# EAGLE design coop assistant (EAGLE 9.6.2)

## Sheet 1 of 3: POWER, MCU, ADC
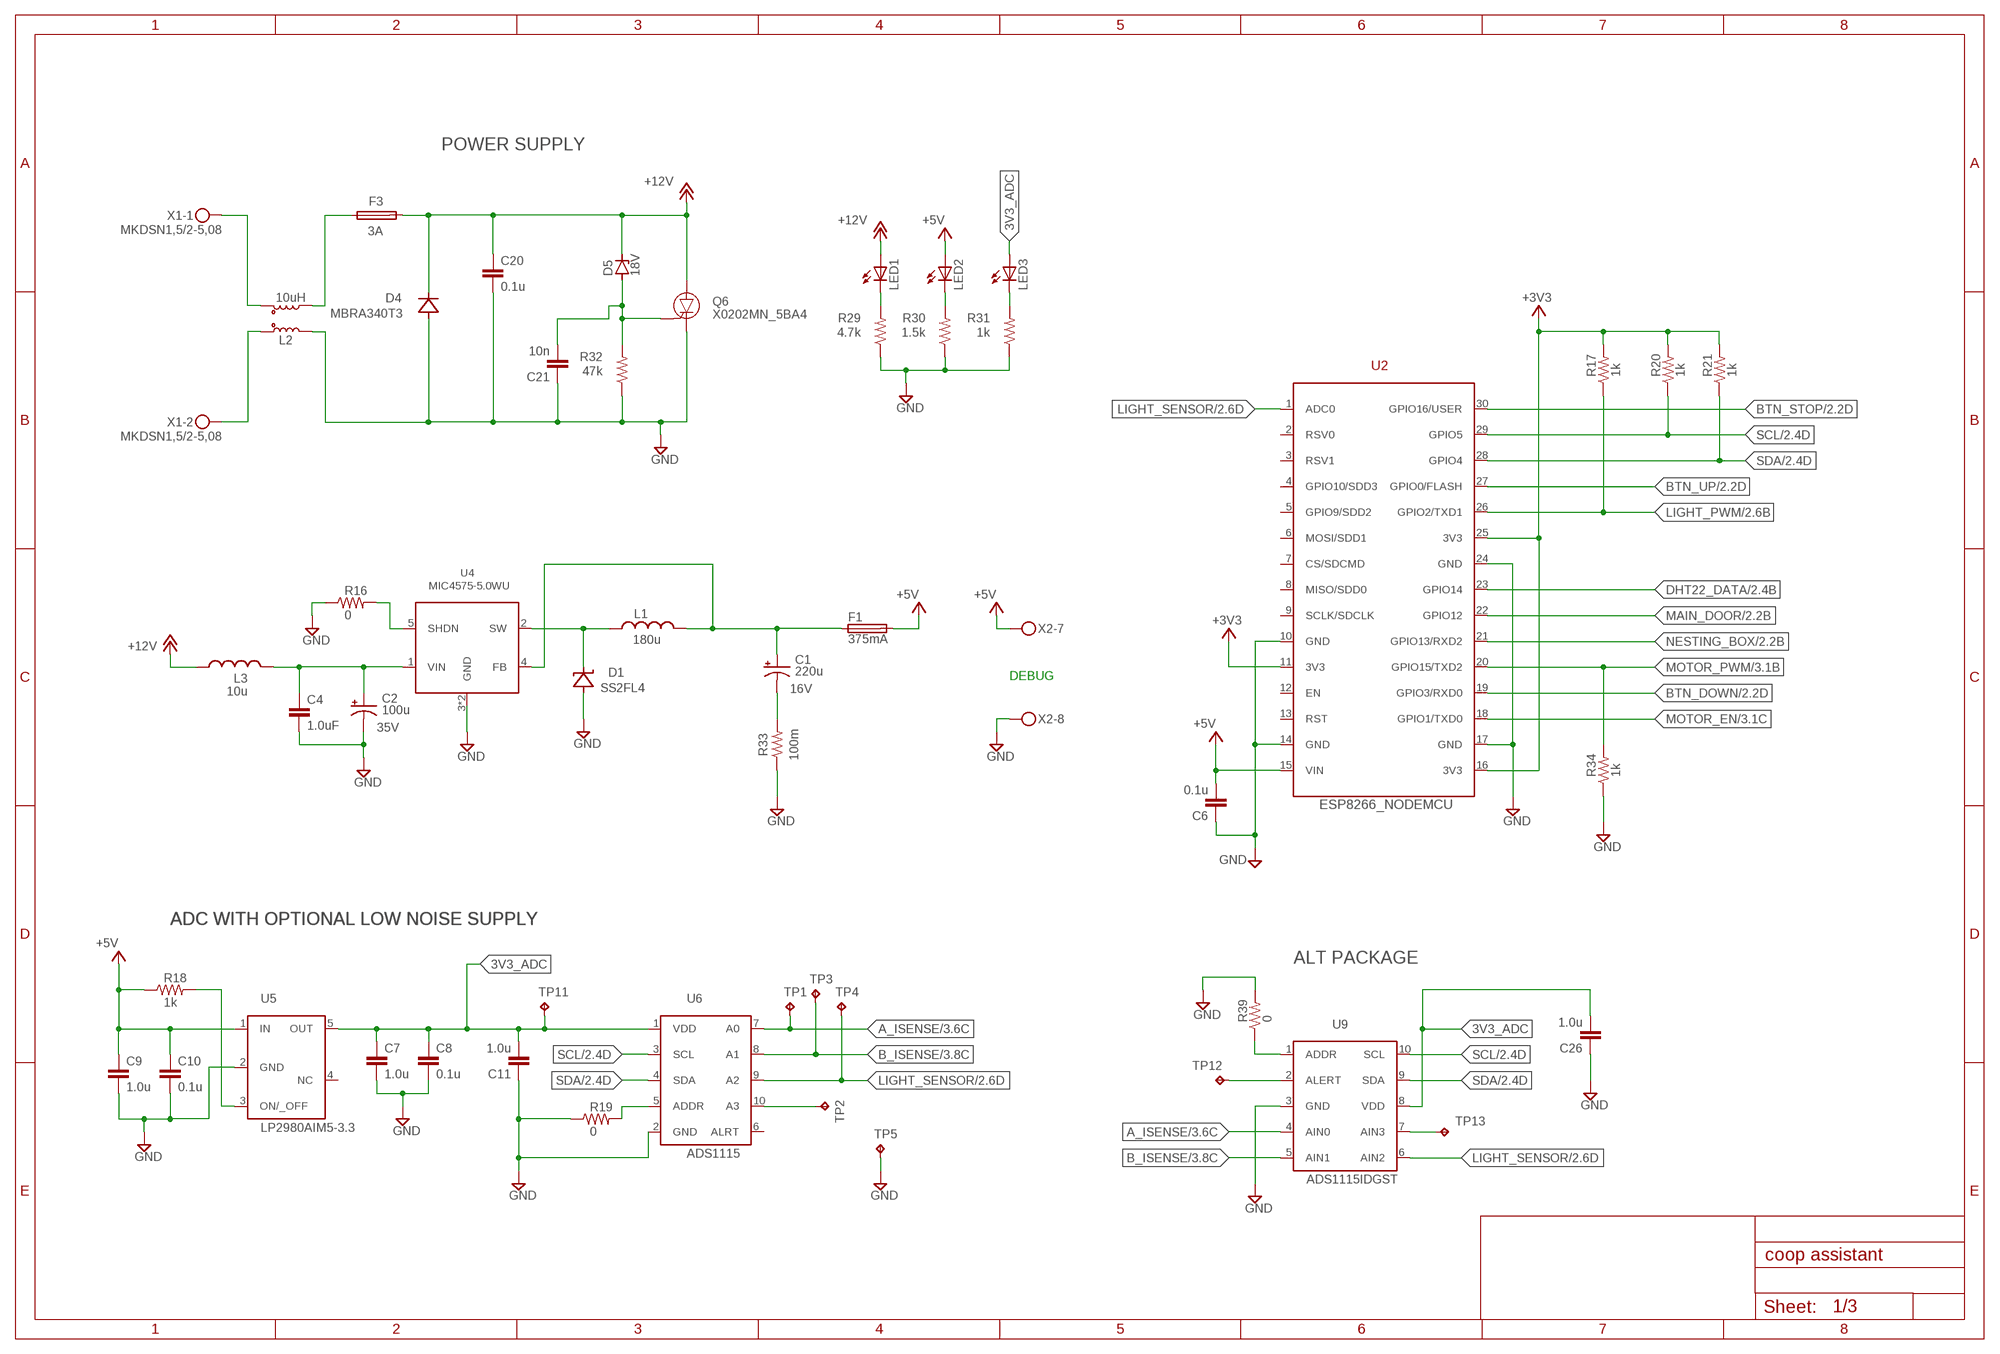
[diagram p0: schematic, sheet 1]

### Parts
C1  220u  CPOLRAD6.3X8  [CAPPRD250W50D630H800B]
C2  100u  CPOLRAD8X12  [CAPPRD350W60D800H1200B]
C4  1.0uF  1.0UF-0805-25V-10%  [0805]
C6  0.1u  1.0UF-0603-16V-10%  [0603]
C7  1.0u  1.0UF-0805-25V-10%  [0805]
C8  0.1u  1.0UF-0603-16V-10%  [0603]
C9  1.0u  1.0UF-0805-25V-10%  [0805]
C10  0.1u  1.0UF-0603-16V-10%  [0603]
C11  1.0u  1.0UF-0805-25V-10%  [0805]
C20  0.1u  C-EUC0805  [C0805]
C21  10n  C-EUC0805  [C0805]
C26  1.0u  1.0UF-0805-25V-10%  [0805]
D1  SS2FL4  [SMF]
D4  MBRA340T3  [SMA]
D5  18V  ZENER-DIODESOT23  [SOT23]
F1  375mA  494SERIESFUSE  [0603]
F3  3A  154_OMNIBLOKF154  [FUSM9750X381N]
L1  180u  MSS1278  [INDM120120X780N]
L2  10uH  COILCRAFT_MSD1260  [COILCRAFT_MSD1260]
L3  10u  MSS1278  [INDM120120X780N]
LED1  LEDCHIP-LED0805  [CHIP-LED0805]
LED2  LEDCHIP-LED0805  [CHIP-LED0805]
LED3  LEDCHIP-LED0805  [CHIP-LED0805]
Q6  X0202MN_5BA4  [SOT-223]
R16  0  R-US_R0805  [R0805]
R17  1k  R-US_R0805  [R0805]
R18  1k  R-US_R0805  [R0805]
R19  0  R-US_R0805  [R0805]
R20  1k  R-US_R0805  [R0805]
R21  1k  R-US_R0805  [R0805]
R29  4.7k  R-US_R0805  [R0805]
R30  1.5k  R-US_R0805  [R0805]
R31  1k  R-US_R0805  [R0805]
R32  47k  R-US_R0805  [R0805]
R33  100m  R-US_CHIP-1206(3216-METRIC)  [RESC3216X70]
R34  1k  R-US_R0805  [R0805]
R39  0  R-US_R0805  [R0805]
TP1  TPTP15SQ  [TP15SQ]
TP2  TPTP15SQ  [TP15SQ]
TP3  TPTP15SQ  [TP15SQ]
TP4  TPTP15SQ  [TP15SQ]
TP5  TPTP15SQ  [TP15SQ]
TP11  TPTP15SQ  [TP15SQ]
TP12  TPTP15SQ  [TP15SQ]
TP13  TPTP15SQ  [TP15SQ]
U2  ESP8266_NODEMCU  [NODEMCUESP8266]
U4  MIC4575-5.0WU  [TO263-5]
U5  LP2980AIM5-3.3  [SOT23-5]
U6  ADS1115  [HDRV10W64P254_1X10_2800X508X838B]
U9  ADS1115IDGST  [10VSSOP]
X1  MKDSN1,5/2-5,08  [MKDSN1,5/2-5,08]
X2  MKDSN1,5/8-5,08  [MKDSN1,5/8-5,08]

### Nets
3V3_ADC [Power]: C7.1 C8.1 C11.2 C26.2 LED3.A TP11.TP U5.5(OUT) U6.1(VDD) U9.8(VDD)
5VBUCK_SHDN [Power]: R16.2 U4.5(SHDN)
5VBUCK_SW [Power]: D1.K(C) L1.1 U4.2(SW)
5VBUCK_VIN [Power]: C2.POS(+) C4.1 L3.2 U4.1(VIN)
5VBUCK_VOUT [Power]: C1.POS(+) F1.1 L1.2 U4.4(FB)
5VBUCK_VOUT_ESR [Power]: C1.NEG(-) R33.2
+3V3 [Power]: R17.2 R20.2 R21.2 U2.11(3V3) U2.16(3V3) U2.25(3V3) ; also sheet 2,3
+5V [Power]: C6.2 C9.1 C10.1 F1.2 LED2.A R18.1 U2.15(VIN) U5.1(IN) X2.7
+12V [Power]: C20.1 D4.C D5.3(C) F3.2 L3.1 LED1.A Q6.A Q6.A1(A) ; also sheet 2,3
+12V_PREFUSE [Power]: F3.1 L2.3
A_ISENSE [Analog]: TP1.TP U6.7(A0) U9.4(AIN0) ; also sheet 3
ADS1115_ADDR [Logic]: R19.2 U6.5(ADDR)
B_ISENSE [Analog]: TP3.TP U6.8(A1) U9.5(AIN1) ; also sheet 3
BTN_DOWN [Control]: U2.19(GPIO3/RXD0) ; also sheet 2
BTN_STOP [Control]: U2.30(GPIO16/USER) ; also sheet 2
BTN_UP [Control]: U2.27(GPIO0/FLASH) ; also sheet 2
DHT22_DATA [Logic]: U2.23(GPIO14) ; also sheet 2
GND [Power]: C2.NEG(-) C4.2 C6.1 C7.2 C8.2 C9.2 C10.2 C11.1 C20.2 C21.1 C26.1 D1.A D4.A L2.4 Q6.K R16.1 R19.1 R29.1 R30.1 R31.1 R32.1 R33.1 R34.1 R39.2 TP5.TP U2.10(GND) U2.14(GND) U2.17(GND) U2.24(GND) U4.3(GND) U4.6(GND) U5.2(GND) U6.2(GND) U9.3(GND) X2.8 ; also sheet 2,3
LED_3V3_ADC [Analog]: LED3.C R31.2
LED_5V [Analog]: LED2.C R30.2
LED_12V [Analog]: LED1.C R29.2
LIGHT_PWM [Control]: R17.1 U2.26(GPIO2/TXD1) ; also sheet 2
LIGHT_SENSOR [Control]: TP4.TP U2.1(ADC0) U6.9(A2) U9.6(AIN2) ; also sheet 2
MAIN_DOOR [Control]: U2.22(GPIO12) ; also sheet 2
MOTOR_EN [Control]: U2.18(GPIO1/TXD0) ; also sheet 3
MOTOR_PWM [Control]: R34.2 U2.20(GPIO15/TXD2) ; also sheet 3
N$1: TP2.TP U6.10(A3)
N$2: TP12.TP U9.2(ALERT)
N$3: R39.1 U9.1(ADDR)
N$4: TP13.TP U9.7(AIN3)
NESTING_BOX [Control]: U2.21(GPIO13/RXD2) ; also sheet 2
SCL [Logic]: R20.1 U2.29(GPIO5) U6.3(SCL) U9.10(SCL) ; also sheet 2
SDA [Logic]: R21.1 U2.28(GPIO4) U6.4(SDA) U9.9(SDA) ; also sheet 2
VADC_EN [Logic]: R18.2 U5.3(ON/_OFF)
VIN+ [Power]: L2.1 X1.1
VIN- [Power]: L2.2 X1.2
VIN_CROWBAR_GATE [Control]: C21.2 D5.1(A) Q6.G R32.2
Unconnected: U2.2(RSV0) U2.3(RSV1) U2.4(GPIO10/SDD3) U2.5(GPIO9/SDD2) U2.6(MOSI/SDD1) U2.7(CS/SDCMD) U2.8(MISO/SDD0) U2.9(SCLK/SDCLK) U2.12(EN) U2.13(RST) U5.4(NC) U6.6(ALRT)

### Notes on the sheet
- POWER SUPPLY
- DEBUG
- ADC WITH OPTIONAL LOW NOISE SUPPLY | ADC WITH OPTIONAL LOW NOISE SUPPLY
- ALT PACKAGE

## Sheet 2 of 3: SENSORS AND INPUTS
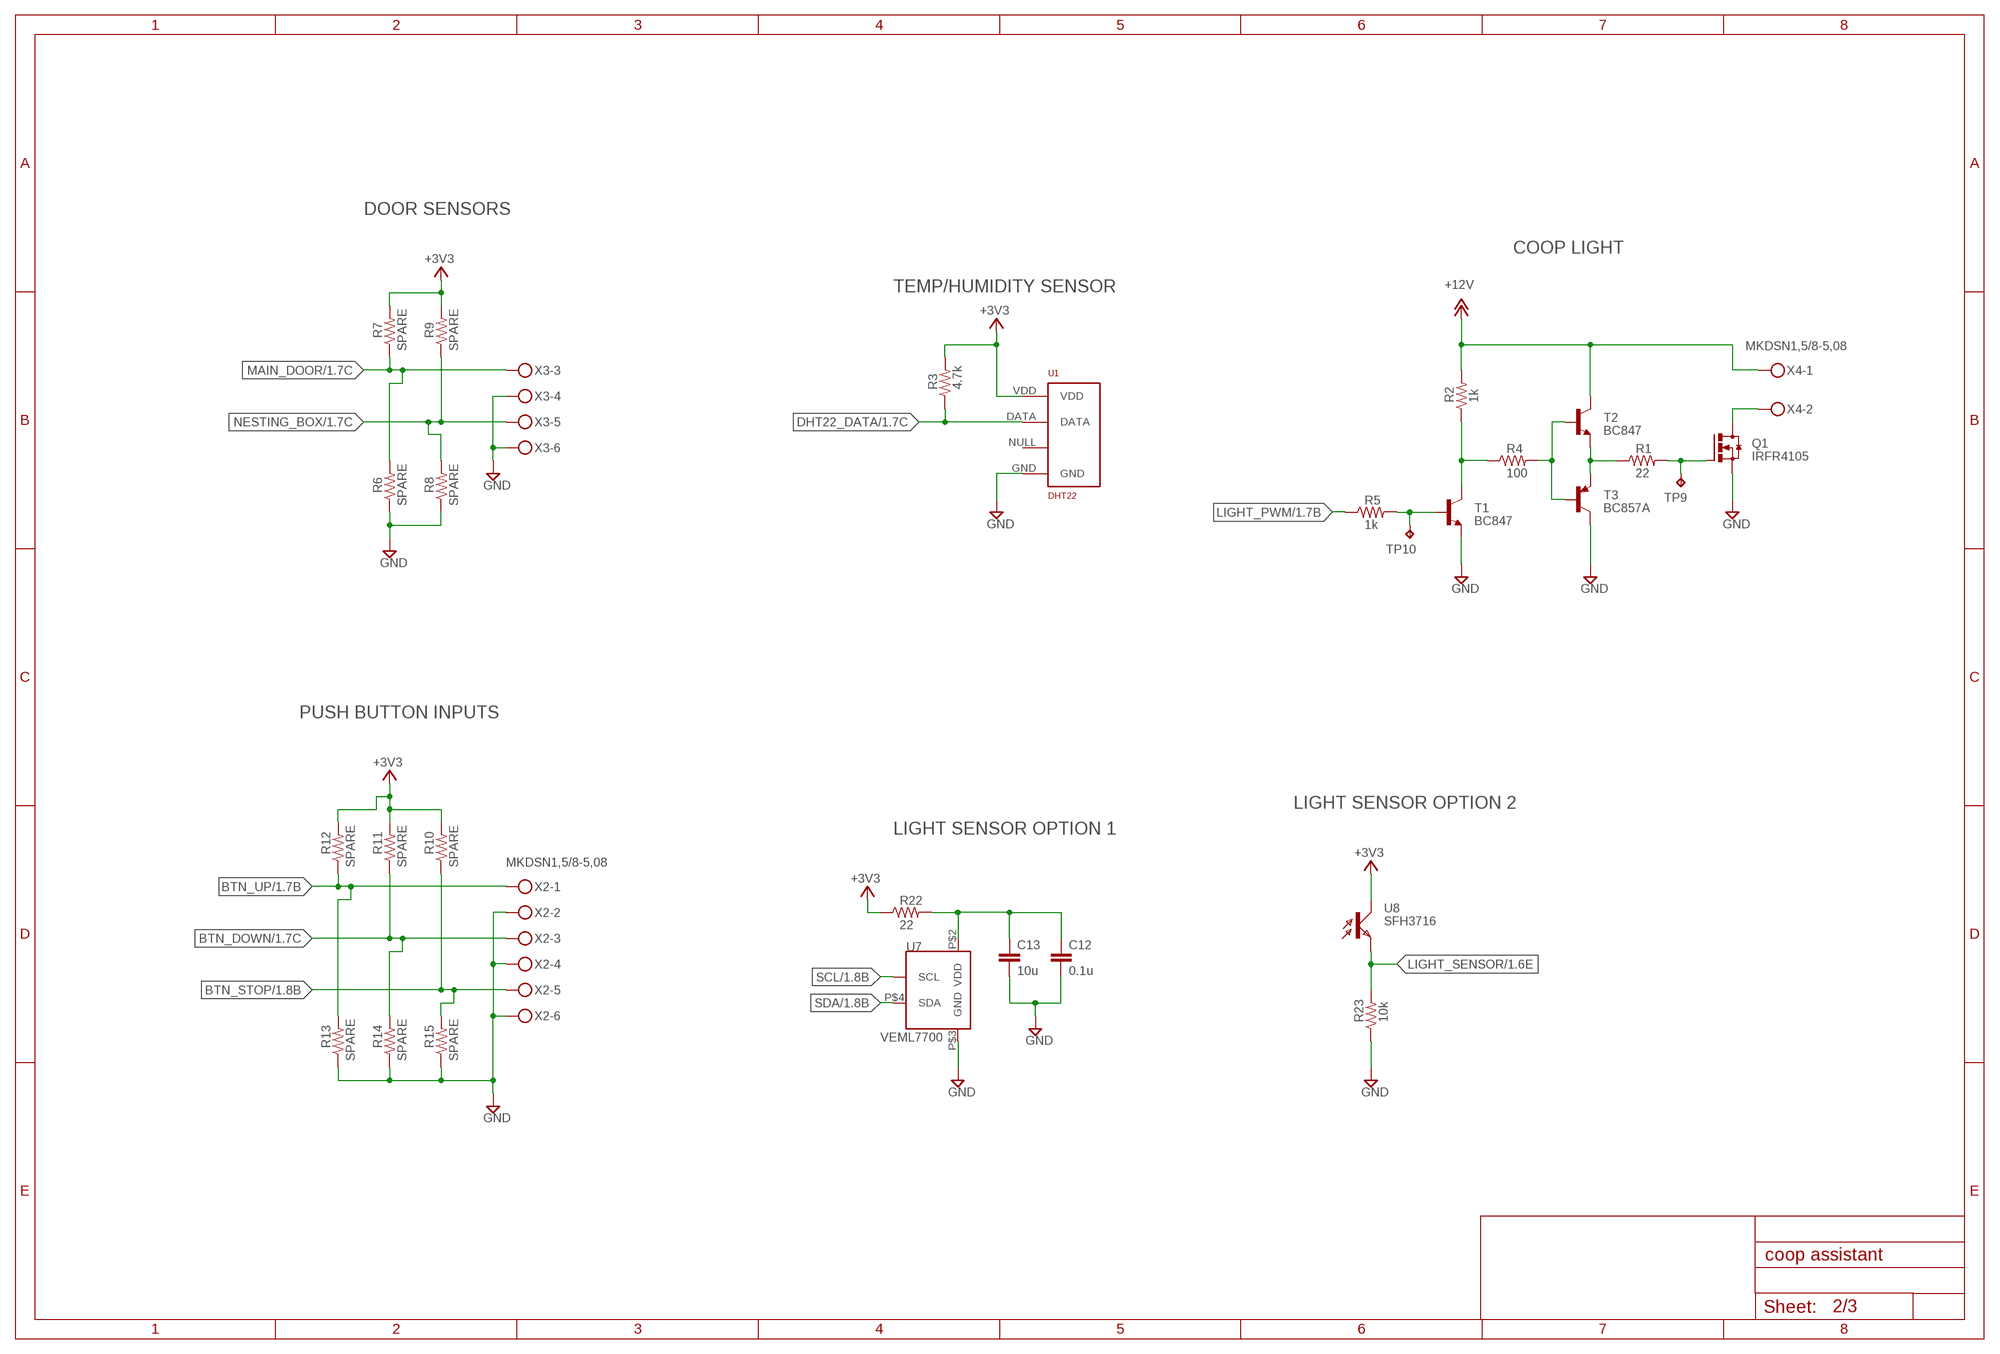
[diagram p1: schematic, sheet 2]

### Parts
C12  0.1u  1.0UF-0603-16V-10%  [0603]
C13  10u  1.0UF-0805-25V-(+80/-20%)  [0805]
Q1  IRFR4105  [TO252]
R1  22  R-US_R0805  [R0805]
R2  1k  R-US_R0805  [R0805]
R3  4.7k  R-US_R0805  [R0805]
R4  100  R-US_R0805  [R0805]
R5  1k  R-US_R0805  [R0805]
R6  SPARE  R-US_R0805  [R0805]
R7  SPARE  R-US_R0805  [R0805]
R8  SPARE  R-US_R0805  [R0805]
R9  SPARE  R-US_R0805  [R0805]
R10  SPARE  R-US_R0805  [R0805]
R11  SPARE  R-US_R0805  [R0805]
R12  SPARE  R-US_R0805  [R0805]
R13  SPARE  R-US_R0805  [R0805]
R14  SPARE  R-US_R0805  [R0805]
R15  SPARE  R-US_R0805  [R0805]
R22  22  R-US_R0805  [R0805]
R23  10k  R-US_R0805  [R0805]
T1  BC847  [SOT23]
T2  BC847  [SOT23]
T3  BC857A  [SOT23-BEC]
TP9  TPTP15SQ  [TP15SQ]
TP10  TPTP15SQ  [TP15SQ]
U1  DHT22  RHT03_DHT-22_AM2302RA  [RHT03_DHT-22/RA]
U7  VEML7700  [VEML7700]
U8  SFH3716  [0805]
X3  MKDSN1,5/8-5,08  [MKDSN1,5/8-5,08]
X4  MKDSN1,5/8-5,08  [MKDSN1,5/8-5,08]

### Nets
+3V3 [Power]: R3.2 R7.2 R9.2 R10.2 R11.2 R12.2 R22.1 U1.VDD U8.1(C) ; also sheet 1,3
+12V [Power]: R2.2 T2.3(C) X4.1 ; also sheet 1,3
BTN_DOWN [Control]: R11.1 R14.2 X2.3 ; also sheet 1
BTN_STOP [Control]: R10.1 R15.2 X2.5 ; also sheet 1
BTN_UP [Control]: R12.1 R13.2 X2.1 ; also sheet 1
DHT22_DATA [Logic]: R3.1 U1.DATA ; also sheet 1
GND [Power]: C12.2 C13.2 Q1.2(S) R6.1 R8.1 R13.1 R14.1 R15.1 R23.1 T1.2(E) T3.C U1.GND U7.P$3(GND) X2.2 X2.4 X2.6 X3.4 X3.6 ; also sheet 1,3
LIGHT_GATE_PRERES [Control]: R1.1 T2.2(E) T3.E
LIGHT_OUT [Light]: Q1.3(D) X4.2
LIGHT_PWM [Control]: R5.1 ; also sheet 1
LIGHT_PWM_BASE [Control]: R5.2 T1.1(B) TP10.TP
LIGHT_PWM_EMITTER [Control]: R2.1 R4.1 T1.3(C)
LIGHT_PWM_TOTEM [Control]: R4.2 T2.1(B) T3.B
LIGHT_SENSOR [Control]: R23.2 U8.2(E) ; also sheet 1
LIGHT_SENSOR_VDD [Control]: C12.1 C13.1 R22.2 U7.P$2(VDD)
LIGHT_VGATE [Control]: Q1.1(G) R1.2 TP9.TP
MAIN_DOOR [Control]: R6.2 R7.1 X3.3 ; also sheet 1
NESTING_BOX [Control]: R8.2 R9.1 X3.5 ; also sheet 1
SCL [Logic]: U7.P$1(SCL) ; also sheet 1
SDA [Logic]: U7.P$4(SDA) ; also sheet 1
Unconnected: U1.NULL X3.1 X3.2 X3.7 X3.8 X4.3 X4.4 X4.5 X4.6

### Notes on the sheet
- DOOR SENSORS
- COOP LIGHT
- TEMP/HUMIDITY SENSOR
- PUSH BUTTON INPUTS
- LIGHT SENSOR OPTION 2
- LIGHT SENSOR OPTION 1

## Sheet 3 of 3: MOTOR DRIVE
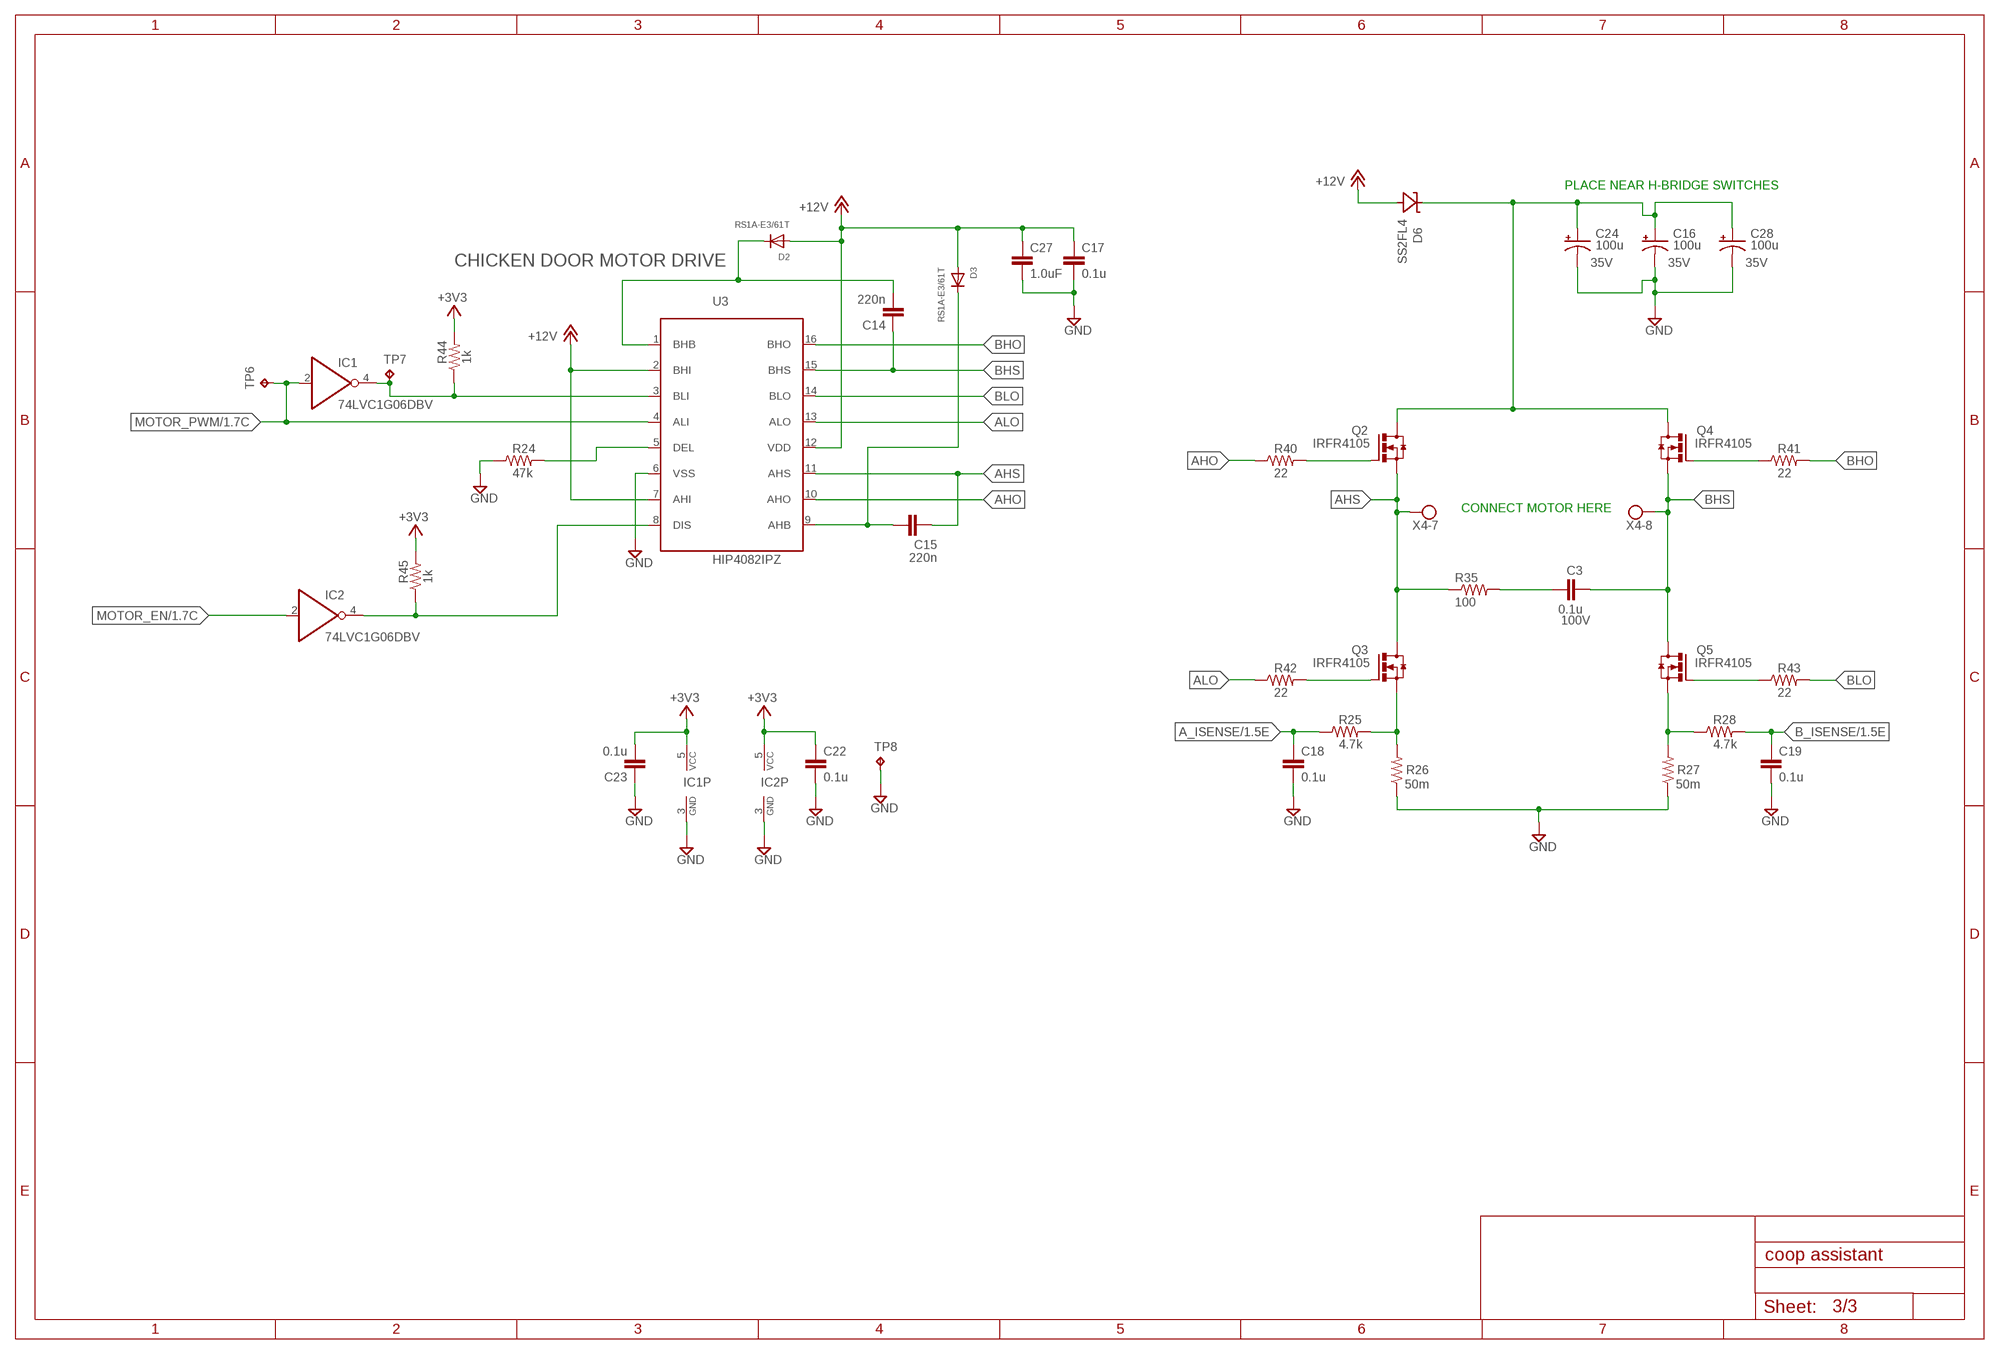
[diagram p2: schematic, sheet 3]

### Parts
C3  0.1u  C-EUC0805  [C0805]
C14  220n  1.0UF-0805-25V-(+80/-20%)  [0805]
C15  220n  1.0UF-0805-25V-(+80/-20%)  [0805]
C16  100u  CPOLRAD8X12  [CAPPRD350W60D800H1200B]
C17  0.1u  1.0UF-0603-16V-10%  [0603]
C18  0.1u  1.0UF-0603-16V-10%  [0603]
C19  0.1u  1.0UF-0603-16V-10%  [0603]
C22  0.1u  1.0UF-0603-16V-10%  [0603]
C23  0.1u  1.0UF-0603-16V-10%  [0603]
C24  100u  CPOLRAD8X12  [CAPPRD350W60D800H1200B]
C27  1.0uF  1.0UF-0805-25V-10%  [0805]
C28  100u  CPOLRAD8X12  [CAPPRD350W60D800H1200B]
D2  RS1A-E3/61T  DIODESMA  [SMADIODE]
D3  RS1A-E3/61T  DIODESMA  [SMADIODE]
D6  SS2FL4  [SMF]
IC1  74LVC1G06DBV  [SOT23-5]
IC2  74LVC1G06DBV  [SOT23-5]
Q2  IRFR4105  [TO252]
Q3  IRFR4105  [TO252]
Q4  IRFR4105  [TO252]
Q5  IRFR4105  [TO252]
R24  47k  R-US_R0805  [R0805]
R25  4.7k  R-US_R0805  [R0805]
R26  50m  R-US_R2512  [R2512]
R27  50m  R-US_R2512  [R2512]
R28  4.7k  R-US_R0805  [R0805]
R35  100  R-US_R2512  [R2512]
R40  22  R-US_R0805  [R0805]
R41  22  R-US_R0805  [R0805]
R42  22  R-US_R0805  [R0805]
R43  22  R-US_R0805  [R0805]
R44  1k  R-US_R0805  [R0805]
R45  1k  R-US_R0805  [R0805]
TP6  TPTP15SQ  [TP15SQ]
TP7  TPTP15SQ  [TP15SQ]
TP8  TPTP15SQ  [TP15SQ]
U3  HIP4082IPZ  [DIP762W53P254L1969H508Q16B]

### Nets
+3V3 [Power]: C22.1 C23.2 IC1.5(VCC) IC2.5(VCC) R44.2 R45.2 ; also sheet 1,2
+12V [Power]: C17.1 C27.1 D2.A D3.A D6.A U3.2(BHI) U3.7(AHI) U3.12(VDD) ; also sheet 1,2
+12V_MOTOR [Power]: C16.POS(+) C24.POS(+) C28.POS(+) D6.K(C) Q2.3(D) Q4.3(D)
/MOTOR_EN [Control]: IC2.4(O) R45.1 U3.8(DIS)
/MOTOR_PWM [Control]: IC1.4(O) R44.1 TP7.TP U3.3(BLI)
A_ISENSE [Analog]: C18.1 R25.1 ; also sheet 1
AHO [Control]: R40.1 U3.10(AHO)
AHO_G: Q2.1(G) R40.2
AHS [Motor]: C15.2 Q2.2(S) Q3.3(D) R35.1 U3.11(AHS) X4.7
ALO [Control]: R42.1 U3.13(ALO)
ALO_G: Q3.1(G) R42.2
ALS [Motor]: Q3.2(S) R25.2 R26.2
B_ISENSE [Analog]: C19.1 R28.2 ; also sheet 1
BHO [Control]: R41.2 U3.16(BHO)
BHO_G: Q4.1(G) R41.1
BHS [Motor]: C3.2 C14.1 Q4.2(S) Q5.3(D) U3.15(BHS) X4.8
BLO [Control]: R43.2 U3.14(BLO)
BLO_G: Q5.1(G) R43.1
BLS [Motor]: Q5.2(S) R27.2 R28.1
GND [Power]: C16.NEG(-) C17.2 C18.2 C19.2 C22.2 C23.1 C24.NEG(-) C27.2 C28.NEG(-) IC1.3(GND) IC2.3(GND) R24.1 R26.1 R27.1 TP8.TP U3.6(VSS) ; also sheet 1,2
HIP4082_BOOTA [Control]: C15.1 D3.C U3.9(AHB)
HIP4082_BOOTB [Control]: C14.2 D2.C U3.1(BHB)
HIP4082_DLY [Logic]: R24.2 U3.5(DEL)
MOTOR_EN [Control]: IC2.2(I) ; also sheet 1
MOTOR_PWM [Control]: IC1.2(I) TP6.TP U3.4(ALI) ; also sheet 1
MOTOR_SNUB_RC [Power]: C3.1 R35.2

### Notes on the sheet
- PLACE NEAR H-BRIDGE SWITCHES
- CHICKEN DOOR MOTOR DRIVE
- CONNECT MOTOR HERE

## Library data of the parts
C1 = Jeremy Custom Parts:CPOLRAD6.3X8: Radial Solid Polymer Aluminum Capacitors; VOLTAGE: 16V
C2 C16 C24 C28 = Jeremy Custom Parts:CPOLRAD8X12: Kemet Radial Solid Polymer Aluminum Capacitors https://www.mouser.com/datasheet/2/212/KEM_A4072_A759-1104329.pdf; VOLTAGE: 35V
C3 = rcl:C-EU: CAPACITOR, European symbol; SPICEPREFIX: C; VOLTAGE: 100V
C4 C27 = SparkFun-Capacitors:1.0UF: 1µF ceramic capacitors A capacitor is a passive two-terminal electrical component used to store electrical energy temporarily in an electric field.; PROD_ID: CAP-08064
C6 C8 C10 C12 C17-C19 C22 C23 = SparkFun-Capacitors:1.0UF: 1µF ceramic capacitors A capacitor is a passive two-terminal electrical component used to store electrical energy temporarily in an electric field.; PROD_ID: CAP-00868; VALUE: 1.0uF
C7 C9 C11 C26 = SparkFun-Capacitors:1.0UF: 1µF ceramic capacitors A capacitor is a passive two-terminal electrical component used to store electrical energy temporarily in an electric field.; PROD_ID: CAP-08064; VALUE: 1.0uF
C13-C15 = SparkFun-Capacitors:1.0UF: 1µF ceramic capacitors A capacitor is a passive two-terminal electrical component used to store electrical energy temporarily in an electric field.; PROD_ID: CAP-11625; VALUE: 1.0uF
C20 C21 = rcl:C-EU: CAPACITOR, European symbol; SPICEPREFIX: C
D1 D6 = Jeremy Custom Parts:SS2FL4: SCHOTTKY DIODE, 40V/2A
D2 D3 = adafruit:DIODE: Diode SMADIODE - SMA Surface Mount Package 20V 1A Schottky Diode Digikey: 641-1014-6-ND DO-1N4148 - Through Hole Small Current Diode SOD-123 20V 1 A (.5mV Vf) Schottky Diode - Digikey: MBRX120TPMSCT-ND SOD-323 10V 570mA (.38mV Vf, 3ns) Schottky Diode - Digikey: ZLLS410CT-ND SOD-523 30V 30mA Schottky Diode (RB751S-40TE61) - Digikey: RB751S-40TE61CT-ND SOT23-R/W - SOT23 Package (R = Solder Paste/Reflow Ovens, W = Hand-Soldering) BAT54Film 40V 300mA - Digikey: 497-7162-1-ND
D4 = diode:MBRA340T3: Surface Mount Schottky Power Rectifier Source: http://www.onsemi.com/pub_link/Collateral/MBRA340T3-D.PDF
D5 = diode:ZENER-DIODE: Z-Diode
F1 = Jeremy Custom Parts:494SERIESFUSE
F3 = Jeremy Custom Parts:154_OMNIBLOK
IC1 IC2 = 74xx-little-de:74*1G06: Single Inverter Buffer/Driver With Open-Drain Output
L1 L3 = Jeremy Custom Parts:MSS1278: SMT Power Inductors
L2 = Jeremy Custom Parts:COILCRAFT_MSD1260: Shielded Coupled Inductors
LED1-LED3 = adafruit:LED: LED OSRAM: - CHIPLED LG R971, LG N971, LY N971, LG Q971, LY Q971, LO R971, LY R971 LH N974, LH R974 LS Q976, LO Q976, LY Q976 LO Q996 - Hyper CHIPLED LW Q18S LB Q993, LB Q99A, LB R99A - SideLED LS A670, LO A670, LY A670, LG A670, LP A670 LB A673, LV A673, LT A673, LW A673 LH A674 LY A675 LS A676, LA A676, LO A676, LY A676, LW A676 LS A679, LY A679, LG A679 - Hyper Micro SIDELED® LS Y876, LA Y876, LO Y876, LY Y876 LT Y87S - SmartLED LW L88C, LW L88S LB L89C, LB L89S, LG L890 LS L89K, LO L89K, LY L89K LS L896, LA L896, LO L896, LY L896 - TOPLED LS T670, LO T670, LY T670, LG T670, LP T670 LSG T670, LSP T670, LSY T670, LOP T670, LYG T670 LG T671, LOG T671, LSG T671 LB T673, LV T673, LT T673, LW T673 LH T674 LS T676, LA T676, LO T676, LY T676, LB T676, LH T676, LSB T676, LW T676 LB T67C, LV T67C, LT T67C, LS T67K, LO T67K, LY T67K, LW E67C LS E67B, LA E67B, LO E67B, LY E67B, LB E67C, LV E67C, LT E67C LW T67C LS T679, LY T679, LG T679 LS T770, LO T770, LY T770, LG T770, LP T770 LB T773, LV T773, LT T773, LW T773 LH T774 LS E675, LA E675, LY E675, LS T675 LS T776, LA T776, LO T776, LY T776, LB T776 LHGB T686 LT T68C, LB T68C - Hyper Mini TOPLED® LB M676 - Mini TOPLED Santana® LG M470 LS M47K, LO M47K, LY M47K Source: http://www.osram.convergy.de/
Q1-Q5 = Jeremy Custom Parts:IRFR4105: MOSFET 55V 1 N-CH HEXFET 45mOhms 22.7nC
Q6 = Thyrsitors:X0202MN_5BA4: SCR 600V 1.25A SOT-223 Manufacturer's datasheet <https://www.st.com/content/ccc/resource/technical/document/datasheet/2d/c1/ab/c5/67/cd/4b/d4/CD00002274.pdf/files/CD00002274.pdf/jcr:content/translations/en.CD00002274.pdf>; CREATED_BY: PCBLayout.com; DIGIKEY_PARTNO: 497-2532-2-ND; MANUFACTURER: STMicroelectronics; MPN: X0202MN 5BA4; PACKAGE: SOT-223
R1-R32 R34 R35 R39-R45 = resistor:R-US_: RESISTOR, American symbol
R33 = Resistor:R-US: Resistor Fixed - ANSI; CATEGORY: Resistor; SUB-CATEGORY: Fixed
T1 T2 = transistor:BC847: NPN TRANSISTOR
T3 = Jeremy Custom Parts:BC857A: 65 V, 100 mA PNP general-purpose transistor
TP1-TP13 = testpad:TP: Test pad
U1 = RHT03_DHT-22_AM2302:RHT03_DHT-22_AM2302: RHT03 / DHT-22 / AM2302 Packages and symbol for the RHT03 / DHT-22 relative humidity and temperature sensor. Note: The AM2302 is a wired version of the DHT-22 which typically requires less clearance and is thus provided as a separate package.; PROD_ID: SEN-10167
U2 = Jeremy Custom Parts:ESP8266_NODEMCU: ESP8266 NODEMCU board.
U3 = Jeremy Custom Parts:HIP4082
U4 = Jeremy Custom Parts:MIC4575-5.0WU: MIC4575 200kHz Simple 1A Buck Regulator
U5 = Jeremy Custom Parts:LP2980AIM5-3.3: Micropower 50-mA Ultra-Low-Dropout Regulator
U6 = Jeremy Custom Parts:ADS1115
U7 = Jeremy Custom Parts:VEML7700
U8 = Jeremy Custom Parts:SFH3716: Silicon NPN Phototransistor with Vλ Characteristics https://www.mouser.com/ProductDetail/OSRAM-Opto-Semiconductors/SFH-3716?qs=z7LT7PaeiGE9bRMCXWA8zg%3D%3D
U9 = Jeremy Custom Parts:ADS1115IDGST
X1 = con-phoenix-508:MKDSN1,5/2-5,08: MKDSN 1,5/ 2-5,08 Printklemme Nennstrom: 13,5 A Nennspannung: 250 V Rastermaß: 5,08 mm Polzahl: 2 Anschlussart: Schraubanschluss Montage: Löten Anschlussrichtung Leiter/Platine: 0 ° Artikelnummer: 1729128 Source: http://eshop.phoenixcontact.com .. 1729128.pdf
X2-X4 = con-phoenix-508:MKDSN1,5/8-5,08: MKDSN 1,5/ 8-5,08 Printklemme Nennstrom: 13,5 A Nennspannung: 250 V Rastermaß: 5,08 mm Polzahl: 8 Anschlussart: Schraubanschluss Montage: Löten Anschlussrichtung Leiter/Platine: 0 ° Artikelnummer: 1729186 Source: http://eshop.phoenixcontact.com .. 1729186.pdf

## Net classes
1 Power: width 0.305 mm, clearance 0.254 mm
2 Logic: width 0.254 mm, clearance 0.203 mm
3 Control: width 0.254 mm, clearance 0.203 mm
4 Analog: width 0.254 mm, clearance 0.203 mm

## Board
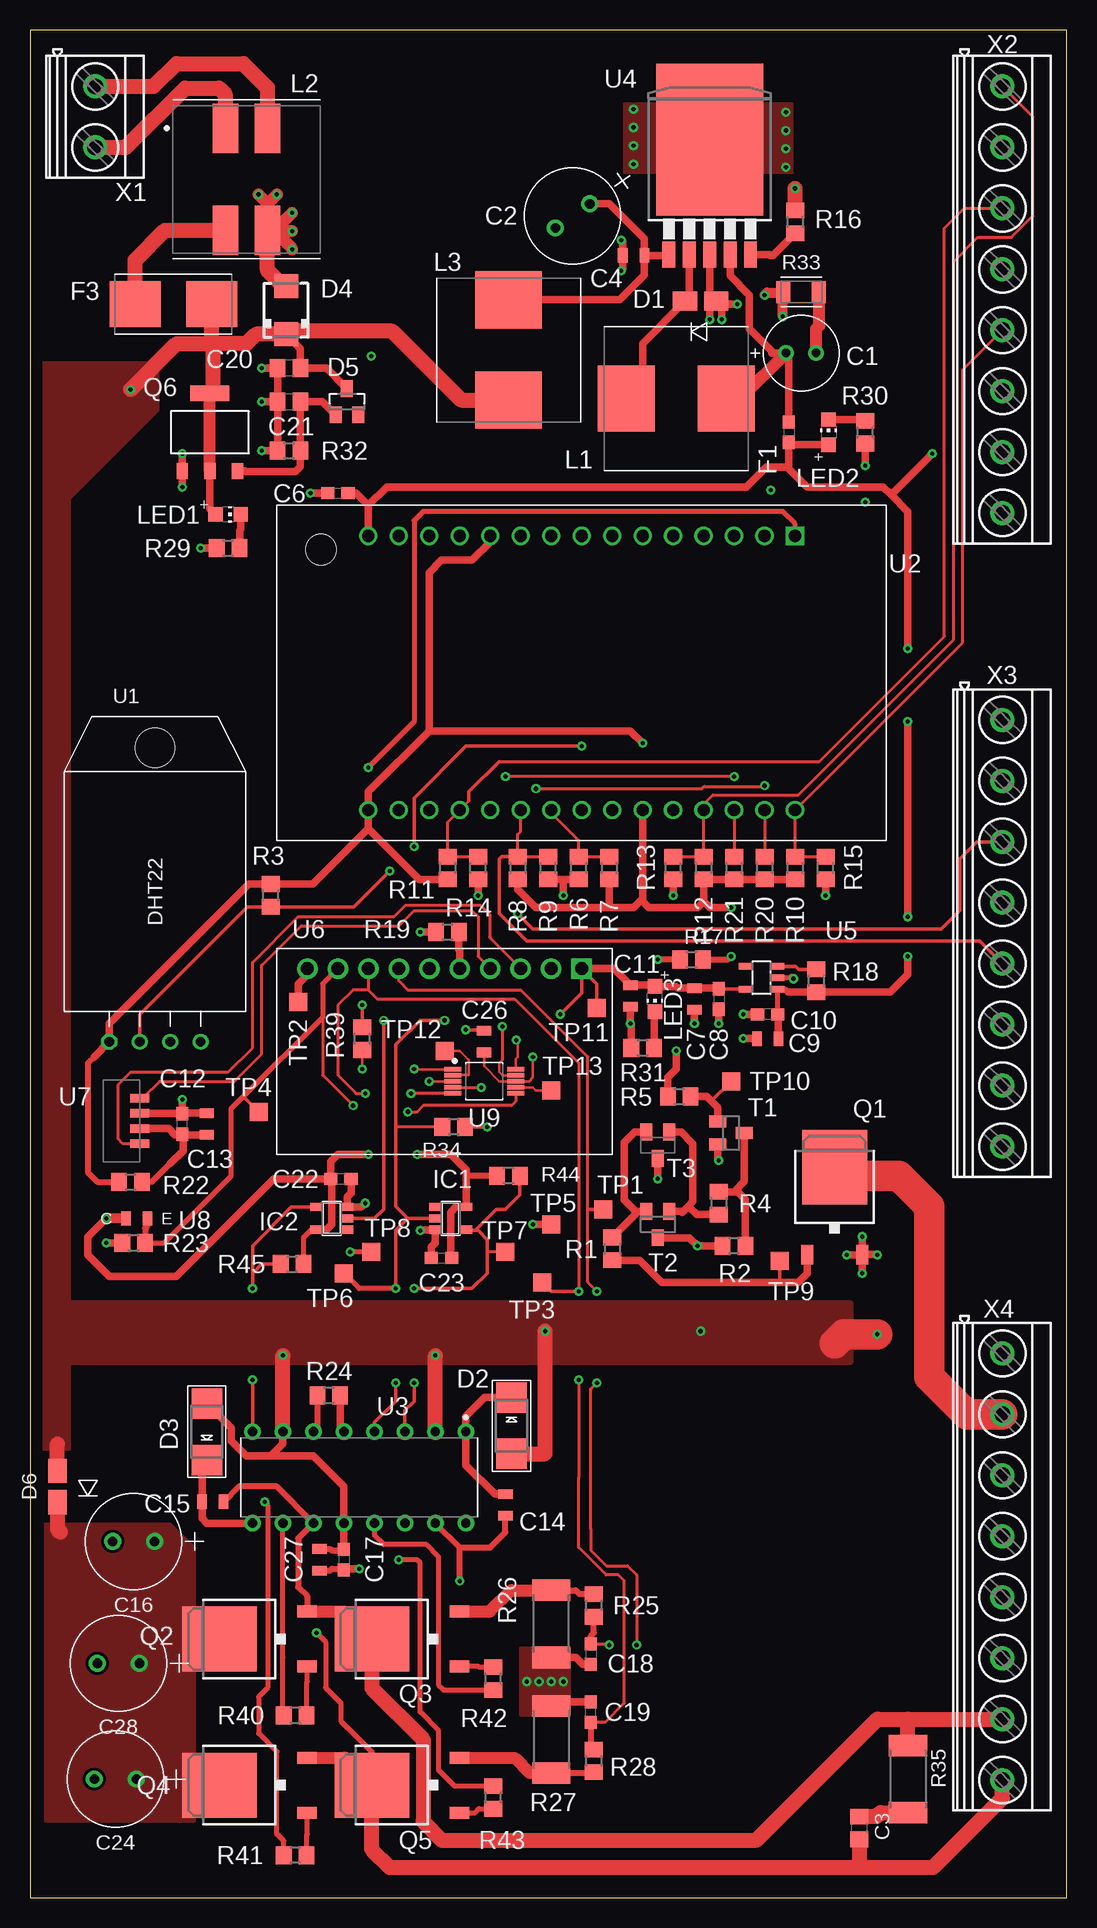
[diagram p3: board, top side]
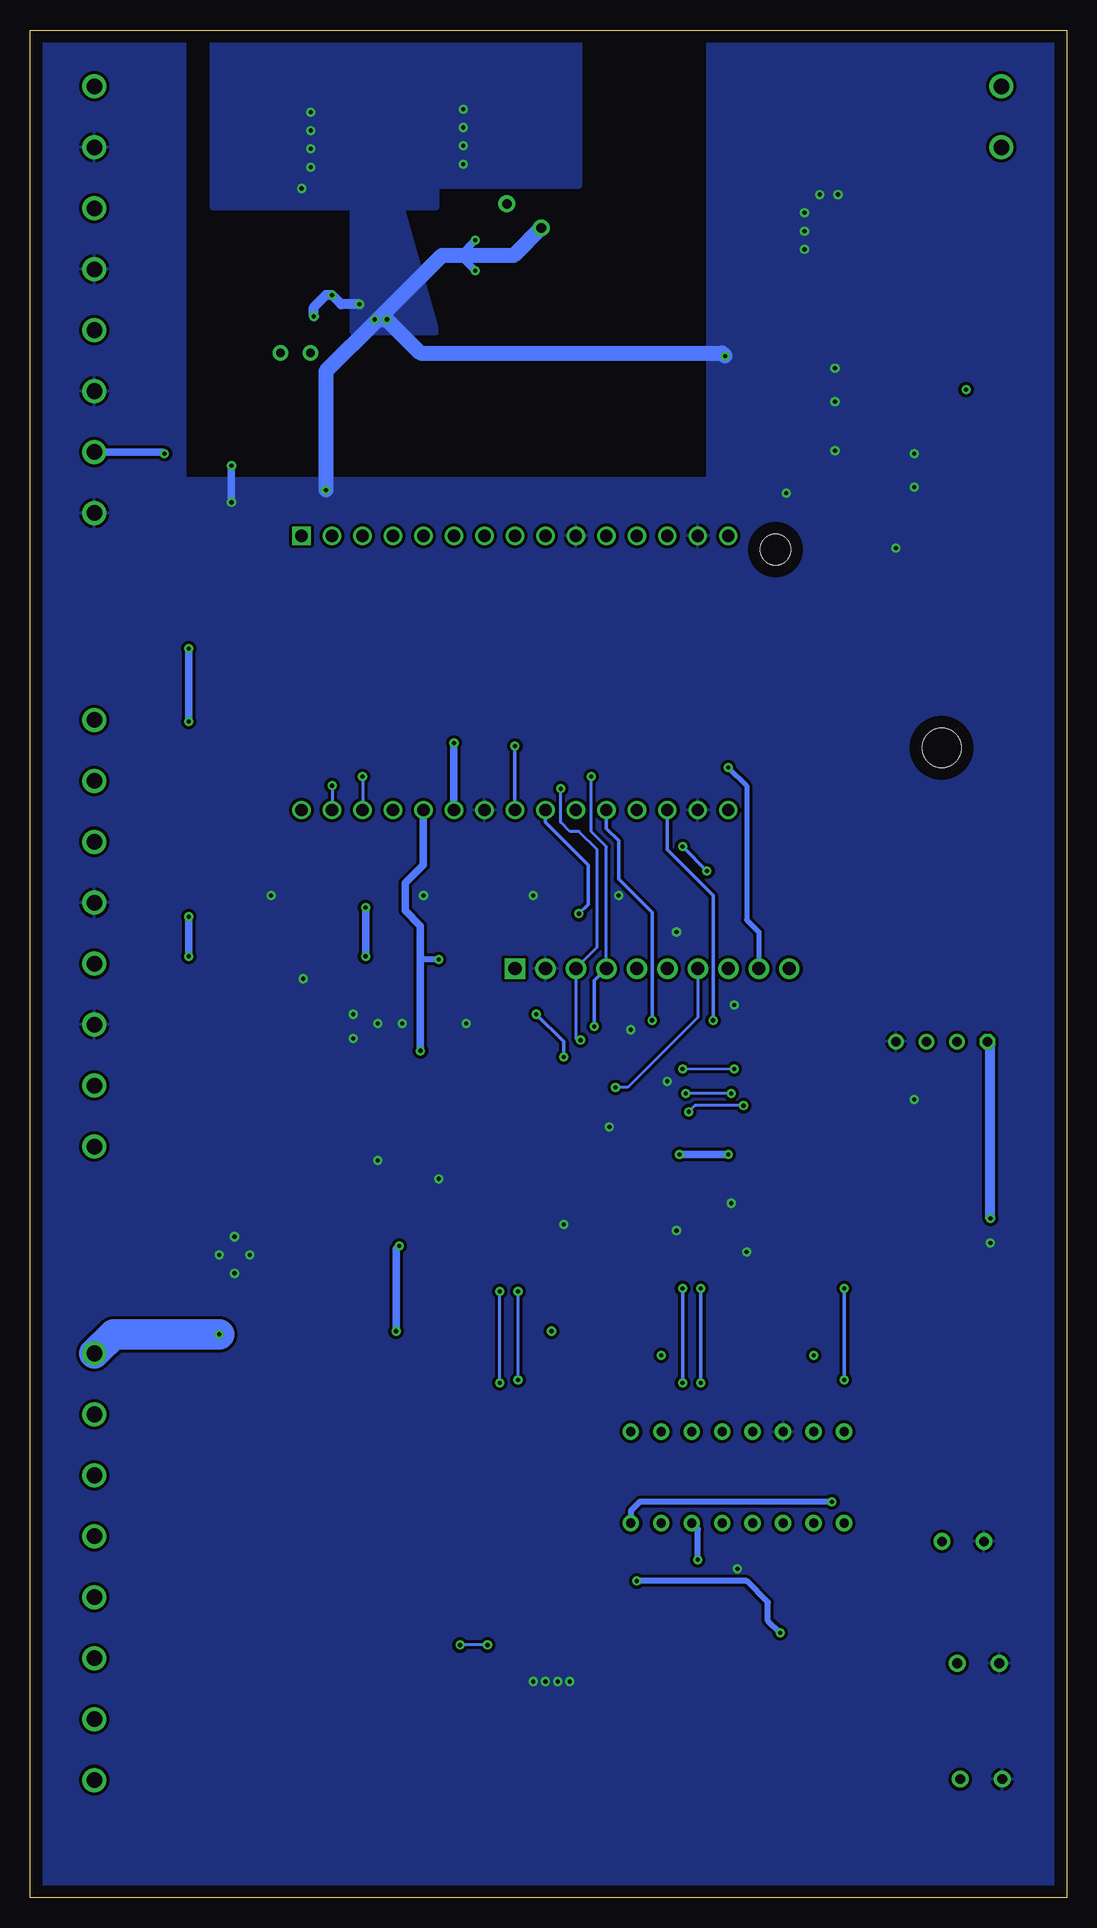
[diagram p4: board, bottom side, seen from below]

Size 86.39 x 155.7 mm. Coordinates in mm from the lower left corner, seen from the top.
Outline: 0,0 86.38,0 86.38,155.7 0,155.7 0,0
Copper layers (1*16): Top 0.035mm / dielectric 1.5mm / Bottom 0.035mm
Design rules "default *": minimum track width 6mil, minimum drill 0.35mm, track to track 6mil, track to pad 6mil, pad to pad 6mil, via to via 6mil, smd to smd 6mil, copper to edge 40mil, drill to drill 6mil, minimum pad ring 10mil, minimum via ring 8mil, stop-mask expansion 4mil, vias tented up to drill 0mil, thermal gap 10mil
Holes 2.54 mm at 24.26,112.39
tKeepout: area -0.3,103 to 12.2,105.5; area 74.2,103 to 86.6,105.5; area 12.2,100.5 to 13.8,108.1; area 12.2,152.1 to 13.8,156; area -0.3,50.2 to 12.2,52.7; area 12.2,47.7 to 13.8,55.3; area 12.2,-0.3 to 13.8,3.6; area 72.5,152.1 to 74.2,156; area 72.5,100.5 to 74.2,108.1; area 74.2,50.2 to 86.6,52.7; area 72.5,47.7 to 74.2,55.3; area 72.5,-0.3 to 74.2,3.6

### Footprints (pad centres in the part's own frame; a part is rotated, then mirrored left to right if it is on the bottom)
CAPPRD250W50D630H800B = drill 0.7 pad 1.3: NEG 1.25,0; POS -1.25,0
CAPPRD350W60D800H1200B = drill 0.8 pad 1.4: NEG 1.75,0; POS -1.75,0
C0805 = smd 1.3 x 1.5: 1 -0.95,0; 2 0.95,0
0805 = smd 0.8 x 1.2: 1 -0.9,0; 2 0.9,0
0603 = smd 1.1 x 1: 1 -0.85,0; 2 0.85,0
SMF = smd 2.015 x 1.572: A 1.3,0; K -1.3,0
SMADIODE = smd 2.54 x 2.54: A 2.349,0; C -2.349,0
SMA = smd 2 x 2: A 2,0; C -2,0
SOT23 = smd 1 x 1.4: 1 -0.95,-1.1; 2 0.95,-1.1; 3 0,1.1
FUSM9750X381N = smd 4.242 x 3.81: 1 -3.175,0; 2 3.2,0
SOT23-5 = smd 0.69 x 0.99: 1 -0.95,-1.29; 2 0,-1.29; 3 0.95,-1.29; 4 0.95,1.3; 5 -0.95,1.3
INDM120120X780N = smd 4.762 x 5.512: 1 -4.175,0; 2 4.175,0
COILCRAFT_MSD1260 = smd 2.112 x 4.112: 1 1.75,4.25; 2 -1.75,4.25; 3 -1.75,-4.25; 4 1.75,-4.25
CHIP-LED0805 = smd 1.2 x 1.2: A 0,-1.05; C 0,1.05
TO252 = smd 1 x 1.6: 1 -2.28,-4.8; 2 2.28,-4.8 | smd 5.4 x 6.2: 3 0,2.5
SOT-223 = smd 0.95 x 1.32: A 0,-3.24; G 2.3,-3.24; K -2.3,-3.24 | smd 3.25 x 1.32: A1 0,3.24
R0805 = smd 1.3 x 1.5: 1 -0.95,0; 2 0.95,0
R2512 = smd 1.8 x 3.2: 1 -2.8,0; 2 2.8,0
RESC3216X70 = smd 1.165 x 1.815: 1 -1.475,0; 2 1.475,0
SOT23-BEC = smd 1 x 1.4: B -0.95,-1.1; C 0,1.1; E 0.95,-1.1
TP15SQ = smd 1.5 x 1.5: TP 0,0
RHT03_DHT-22/RA = drill 0.8: DATA -1.27,0; GND 3.81,0; NULL 1.27,0 | drill 0.8 octagon: VDD -3.81,0 | hole 3.25: 0,24.5
NODEMCUESP8266 = drill 1.016 square: 1 0,0 | drill 1.016: 2 0,-2.54; 3 0,-5.08; 4 0,-7.62; 5 0,-10.16; 6 0,-12.7; 7 0,-15.24; 8 0,-17.78; 9 0,-20.32; 10 0,-22.86; 11 0,-25.4; 12 0,-27.94; 13 0,-30.48; 14 0,-33.02; 15 0,-35.56; 16 22.86,-35.56; 17 22.86,-33.02; 18 22.86,-30.48; 19 22.86,-27.94; 20 22.86,-25.4; 21 22.86,-22.86; 22 22.86,-20.32; 23 22.86,-17.78; 24 22.86,-15.24; 25 22.86,-12.7; 26 22.86,-10.16; 27 22.86,-7.62; 28 22.86,-5.08; 29 22.86,-2.54; 30 22.86,0
DIP762W53P254L1969H508Q16B = drill 0.766 pad 1.367: 1 -3.81,8.89; 2 -3.81,6.35; 3 -3.81,3.81; 4 -3.81,1.27; 5 -3.81,-1.27; 6 -3.81,-3.81; 7 -3.81,-6.35; 8 -3.81,-8.89; 9 3.81,-8.89; 10 3.81,-6.35; 11 3.81,-3.81; 12 3.81,-1.27; 13 3.81,1.27; 14 3.81,3.81; 15 3.81,6.35; 16 3.81,8.89
TO263-5 = smd 1.067 x 2.159: 1 -3.404,-5.791; 2 -1.702,-5.791; 3 0,-5.791; 4 1.702,-5.791; 5 3.404,-5.791 | smd 8.89 x 12.7: 6 0,3.81
SOT23-5' = smd 0.55 x 1.2: 1 -0.95,-1.3; 2 0,-1.3; 3 0.95,-1.3; 4 0.95,1.3; 5 -0.95,1.3
HDRV10W64P254_1X10_2800X508X838B = drill 1.105 pad 1.705 square: 1 0,0 | drill 1.105 pad 1.705: 2 2.54,0; 3 5.08,0; 4 7.62,0; 5 10.16,0; 6 12.7,0; 7 15.24,0; 8 17.78,0; 9 20.32,0; 10 22.86,0
VEML7700 = smd 0.711 x 1.6: P$1 -1.905,-1.27; P$2 -0.635,-1.27; P$3 0.635,-1.27; P$4 1.905,-1.27
10VSSOP = smd 1.419 x 0.372: 1 -2.621,1; 2 -2.621,0.5; 3 -2.621,0; 4 -2.621,-0.5; 5 -2.621,-1; 6 2.621,-1; 7 2.621,-0.5; 8 2.621,0; 9 2.621,0.5; 10 2.621,1
MKDSN1,5/2-5,08 = drill 1.3 pad 2: 1 -2.561,0.025; 2 2.519,0.025
MKDSN1,5/8-5,08 = drill 1.3 pad 2: 1 -17.801,0.025; 2 -12.721,0.025; 3 -7.641,0.025; 4 -2.561,0.025; 5 2.519,0.025; 6 7.599,0.025; 7 12.679,0.025; 8 17.759,0.025

### Placement (x,y rotation side)
C1  64.26,128.78 0 top
C2  45.21,140.21 215 top
C3  69.09,5.84 270 top
C4  50.29,136.91 180 top
C6  25.65,117.09 0 top
C7  55.37,74.93 270 top
C8  57.4,74.93 270 top
C9  61.47,71.63 180 top
C10  61.47,73.66 180 top
C11  50.04,75.18 90 top
C12  12.7,64.52 90 top
C13  14.73,64.52 90 top
C14  39.62,32.77 90 top
C15  15.24,33.02 0 top
C16  8.64,29.72 180 top
C17  26.16,28.19 270 top
C18  46.74,20.32 270 top
C19  46.74,15.49 90 top
C20  21.59,127.51 180 top
C21  21.59,124.71 0 top
C22  25.91,59.94 0 top
C23  34.29,53.34 0 top
C24  7.11,9.91 180 top
C26  37.85,71.37 270 top
C27  24.13,28.19 270 top
C28  7.37,19.56 180 top
D1  55.88,133.1 0 top
D2  40.13,39.37 270 top
D3  14.73,38.86 90 top
D4  21.34,132.33 90 top
D5  26.42,124.71 0 top
D6  2.29,34.29 90 top
F1  63.25,122.17 270 top
F3  11.94,132.84 0 top
IC1  35.05,56.64 270 top
IC2  25.15,56.64 90 top
L1  53.85,124.97 0 top
L2  18.03,143.26 0 top
L3  39.88,129.03 90 top
LED1  16.51,115.32 270 top
LED2  66.55,122.17 0 top
LED3  52.07,74.93 180 top
Q1  67.06,58.42 0 top
Q2  18.29,21.59 90 top
Q3  30.99,21.59 90 top
Q4  18.29,9.4 90 top
Q5  30.99,9.4 90 top
Q6  14.99,122.17 0 top
R1  48.51,54.1 270 top
R2  58.67,54.36 180 top
R3  20.07,83.57 90 top
R4  57.4,57.91 270 top
R5  54.1,66.8 0 top
R6  45.72,85.85 90 top
R7  48.26,85.85 270 top
R8  43.18,85.85 90 top
R9  40.64,85.85 270 top
R10  63.75,85.85 270 top
R11  34.8,85.85 270 top
R12  56.13,85.85 270 top
R13  53.59,85.85 90 top
R14  37.34,85.85 90 top
R15  66.29,85.85 90 top
R16  63.75,139.7 270 top
R17  55.12,78.23 0 top
R18  65.53,76.45 90 top
R19  34.8,80.52 0 top
R20  61.21,85.85 270 top
R21  58.67,85.85 270 top
R22  8.38,59.69 0 top
R23  8.64,54.61 0 top
R24  24.89,41.91 0 top
R25  46.99,24.38 90 top
R26  43.43,22.86 90 top
R27  43.43,13.21 270 top
R28  46.99,11.43 90 top
R29  16.51,112.52 0 top
R30  69.6,122.17 90 top
R31  51.05,70.87 0 top
R32  21.59,120.65 0 top
R33  64.26,133.86 0 top
R34  35.31,64.26 180 top
R35  73.15,9.91 270 top
R39  27.69,71.63 90 top
R40  22.1,15.24 0 top
R41  22.1,3.56 180 top
R42  38.61,18.29 90 top
R43  38.61,8.38 90 top
R44  39.88,60.2 180 top
R45  21.84,52.83 0 top
T1  58.42,63.75 270 top
T2  52.32,56.13 180 top
T3  52.32,62.74 180 top
TP1  47.75,57.4 0 top
TP2  22.35,74.68 0 top
TP3  42.67,51.31 0 top
TP4  19.05,65.53 0 top
TP5  43.43,56.13 0 top
TP6  26.16,52.07 0 top
TP7  39.62,53.85 0 top
TP8  28.45,53.85 0 top
TP9  62.48,53.09 0 top
TP10  58.42,68.07 0 top
TP11  47.24,74.17 0 top
TP12  34.54,70.61 0 top
TP13  43.43,67.31 0 top
U1  10.41,71.37 0 top
U2  63.75,113.54 270 top
U3  27.43,35.05 270 top
U4  56.64,142.75 0 top
U5  LP2980AIM5-3.3  [SOT23-5']  60.96,76.71 90 top
U6  45.97,77.47 180 top
U7  7.87,64.77 90 top
U8  8.89,56.64 0 top
U9  37.85,68.07 0 top
X1  5.41,148.44 270 top
X2  81,133.2 270 top
X3  81,80.39 270 top
X4  81,27.58 270 top

### Tracks (layer width: path | path; a pad name or v marks a point on that pad's centre or on a via)
3V3_ADC  (via drill 0.35)
  Top 0.203: C26.2 37.85,69.34 39.12,68.07 U9.8 41.6,68.07 41.91,68.38 v41.91,70.1
  Top 0.305: 57.43,75.76 U5.5 | TP11.TP 47.24,76.2 U6.1 45.97,75.44 v44.2,73.66
  Top 0.635: U6.1 48.51,77.47 48.65,77.47 C11.2 51.97,76.08 LED3.A 53.81,75.98 53.96,75.83 C7.1 57.35,75.83 C8.1 57.43,75.76
  Bottom 0.305: v44.2,73.66 41.91,71.37 v41.91,70.1
5VBUCK_SHDN
  Top 0.635: U4.5 61.67,136.96 61.72,136.91 61.91,136.91 R16.2
5VBUCK_SW
  Top 0.635: U4.2 54.94,133.1 D1.K 51.05,129.57 51.05,128.52 51.05,126.49 51.05,126.35 L1.1
5VBUCK_VIN
  Top 0.635: C4.1 53.19,136.91 U4.1 | C4.1 51.19,138.29 48.27,141.21 C2.POS | L3.2 49.13,133.21 51.19,135.27 C4.1
5VBUCK_VOUT
  Top 0.635: U4.4 58.34,135.2 59.94,133.6 59.94,132.84 59.94,130.81 61.83,128.92 61.83,128.78 C1.POS 63.25,128.54 F1.1
  Top 1.016: C1.POS 59.2,124.97 L1.2
5VBUCK_VOUT_ESR
  Top 0.305: 65.79,133.81 R33.2
  Top 1.016: C1.NEG 65.51,130.79 65.79,131.06 65.79,133.81
+3V3  (via drill 0.35)
  Top 0.406: R45.2 22.79,55.05 23.43,55.69 IC2.5
  Top 0.508: R44.2 36.35,60.2 | 5.33,70.1 4.83,69.6 4.83,60.45 5.59,59.69 R22.1 | v58.42,78.49 58.17,78.23 R17.2
  Top 0.635: R10.2 R20.2 R21.2 R12.2 56.13,83.06 | 56.13,83.06 55.63,82.55 51.56,82.55 51.05,83.06 51.05,83.31 | U2.25 51.05,83.31 | R11.2 32.45,84.9 28.19,89.15 | 28.19,89.15 U2.16 28.19,92.2 33.27,97.28 | R9.2 40.64,84.07 42.16,82.55 48.26,82.55 | 51.05,83.31 50.29,82.55 48.26,82.55 | R7.2 48.26,82.55 | 28.19,89.15 23.56,84.52 R3.2 18.22,84.52 6.6,72.9 U1.VDD 5.33,70.1 | v58.42,82.55 56.64,82.55 56.13,83.06 | U2.11 38.35,113.03 36.83,111.51 34.29,111.51 33.27,110.49 33.27,97.28 | IC2.5 24.7,55.69 25.15,56.13 25.15,59.86 C22.1 | C23.2 35.05,53.43 35.05,57.15 35.49,57.59 IC1.5 36.35,60.2 36.35,60.68 35.05,61.98 v32.26,61.98 | v6.35,56.64 4.83,55.12 4.83,53.59 6.6,51.82 12.19,51.82 20.32,59.94 C22.1 | C22.1 25.06,61.38 25.65,61.98 v28.19,61.98 | v51.05,96.27 50.04,97.28 33.27,97.28
  Top 0.813: U8.1 v6.35,56.64
  Bottom 0.635: v58.42,78.49 v58.42,82.55 | v28.19,61.98 v32.26,61.98 | v51.05,96.27 U2.25
  Bottom 0.813: v6.35,56.64 6.35,71.12 U1.VDD
+5V  (via drill 0.35)
  Top 0.406: 62.26,73.72 U5.1 62.93,75.76 63.18,75.5
  Top 0.61: 63.25,119.13 63.12,119.25 61.34,119.25
  Top 0.635: LED2.A 63.45,121.12 | 63.45,121.12 F1.2 | 63.45,121.12 63.25,120.92 63.25,119.13 64.77,117.6 71.12,117.6 71.75,116.97 | 61.34,119.25 59.69,117.6 29.72,117.6 28.19,116.08 | 28.19,116.08 U2.15 | C6.2 27.18,117.09 28.19,116.08 | v73.15,104.14 73.15,115.57 71.75,116.97 | C9.1 62.37,73.61 C10.1 62.26,73.72 | 63.18,75.5 R18.1 71.69,75.5 73.15,76.96 v73.15,78.49 | v73.15,98.04 v73.15,81.79 | 71.75,116.97 v75.18,120.4
  Bottom 0.635: v73.15,104.14 v73.15,98.04 | v73.15,81.79 v73.15,78.49 | v75.18,120.4 75.31,120.52 X2.7
+12V  (via drill 0.35)
  Top 0.508: C27.1 25.01,29.09 25.15,28.96 25.97,28.96 26.11,29.09
  Top 0.635: D5.3 24.72,127.51 C20.1 22.54,129.13 D4.C | LED1.A 14.99,115.79 Q6.A | T2.3 54.95,55.03 v55.63,54.36 R2.2 | D3.A 16.76,39.18 16.76,38.1 18.03,36.83 20.07,36.83 | U3.7 21.08,37.85 20.07,36.83 | 20.07,36.83 23.62,36.83 26.16,34.29 U3.12 C17.1 26.11,29.09
  Top 1.016: Q6.A Q6.A1
  Top 1.27: L3.1 35.93,124.86 30.19,130.59 21.59,130.59 D4.C 18.83,130.33 18.03,129.54 15.24,129.54 | U3.7 v21.08,45.21 | U3.2 v33.78,45.21 | D2.A 42.93,37.02 v42.93,47.24 | v8.38,125.73 12.19,129.54 15.24,129.54 | 15.24,129.54 15.24,125.67 Q6.A1 | 15.24,129.54 15.14,129.64 F3.2 | D6.A 2.29,37.85
  Top 2.54: 67.06,46.23 67.82,46.99 v70.61,46.99
  Bottom 0.635: v55.63,54.36 55.88,54.1 v55.88,47.24
  Bottom 2.54: v70.61,46.99 79.42,46.99 X4.1
  pour Top: 0.76,128.02 10.67,128.02 10.67,123.95 3.3,116.59 3.3,37.34 0.76,37.34
  pour Top: 68.33,49.53 2.54,49.53 2.54,44.7 68.33,44.7
+12V_MOTOR
  Top 1.27: D6.K 2.29,30.73 2.54,30.48
  pour Top (no thermals): 1.27,31.24 11.68,31.24 13.72,29.21 13.72,6.35 1.27,6.35
+12V_PREFUSE
  Top 1.27: F3.1 8.76,136.53 11.24,139.01 L2.3
/MOTOR_EN  (via drill 0.35)
  Top 0.305: IC2.4 21.78,57.59 18.54,54.36 v18.54,50.8 18.54,52.07 19.3,52.83 R45.1 | v18.54,43.18 U3.8
  Bottom 0.305: v18.54,50.8 v18.54,43.18
/MOTOR_PWM  (via drill 0.35)
  Top 0.254: TP7.TP 38.1,53.85
  Top 0.305: IC1.4 36.42,55.63 37.08,55.63 | 37.08,55.63 37.34,55.63 38.1,54.86 38.1,53.85 38.1,52.07 36.83,50.8 v32,50.8 | v32,42.93 32,41.4 31.24,40.64 U3.3 | R44.1 40.83,58.61 39.62,57.4 38.86,57.4 37.08,55.63
  Bottom 0.305: v32,50.8 v32,42.93
A_ISENSE  (via drill 0.35)
  Top 0.203: U6.7 30.73,76.45
  Top 0.254: 30.73,76.45 31.5,75.69 40.89,75.69 46.48,70.1 46.48,57.4 46.48,51.31 v47.24,50.55 | C18.1 48.17,21.17 v48.26,21.08 | v47.24,42.93 46.74,42.42 46.74,30.73 46.74,28.96 48.01,27.69 49.78,27.69 50.55,26.92 v50.55,21.08 | U9.4 37.58,67.57 v37.59,67.56
  Top 0.305: TP1.TP 46.48,57.4
  Top 0.508: C18.1 46.74,21.84 46.99,22.1 R25.1
  Bottom 0.254: v48.26,21.08 v50.55,21.08 | v47.24,42.93 v47.24,50.55 | v37.59,67.56 36.58,67.56 30.73,73.41 U6.7
ADS1115_ADDR
  Top 0.635: U6.5 35.81,78.99 35.75,79.06 R19.2
AHO
  Top 0.406: U3.10 21.08,20.07 21.08,15.31 R40.1
AHO_G
  Top 0.406: R40.2 23.05,17.97 23.11,18.03 23.11,19.28 Q2.1
AHS
  Top 0.508: C15.2 17.41,34.29 20.57,34.29 U3.11 22.35,29.97 22.35,25.91 23.09,25.17 Q2.2
  Top 1.016: Q2.2 26.2,23.88 Q3.3
  Top 1.27: Q3.3 28.49,17.49 32.77,13.21 32.77,6.35 34.29,4.83 60.53,4.83 70.61,14.91 73.15,14.91 | 73.15,14.91 X4.7 | R35.1 73.15,14.91
ALO
  Top 0.406: U3.13 28.7,30.23 29.46,29.46 33.02,29.46 34.04,28.45 34.04,17.78 34.48,17.34 R42.1
ALO_G
  Top 0.406: R42.2 37.4,19.24 37.33,19.31 Q3.1
ALS
  Top 0.508: R26.2 45.46,25.66 45.79,25.33 R25.2
  Top 1.016: Q3.2 38.33,23.87 40.12,25.66 R26.2
B_ISENSE  (via drill 0.35)
  Top 0.254: U6.8 28.19,75.69 | 28.19,75.69 28.96,74.93 40.39,74.93 45.72,69.6 v45.72,50.55 | v45.72,43.18 45.72,35.05 45.72,29.21 48.01,26.92 49.02,26.92 49.53,26.42 49.53,16.26 47.92,14.64 C19.1 | 28.19,75.69 26.92,75.69 25.65,74.42 25.65,68.58 27.18,67.06 v27.94,67.06 | U9.5 33.54,67.07 33.53,67.06 v31.75,67.06
  Top 0.305: TP3.TP 43.43,50.55 v45.72,50.55
  Top 0.508: R28.2 46.74,12.63 C19.1
  Bottom 0.254: v45.72,50.55 v45.72,43.18 | v27.94,67.06 v31.75,67.06
BHO  (via drill 0.35)
  Top 0.406: v19.56,33.02 19.81,32.77 19.81,17.53 19.05,16.76 19.05,13.72 20.57,12.19 20.57,5.33 21.15,4.76 R41.2
  Bottom 0.508: v19.56,33.02 35.56,33.02 36.32,32.26 U3.16
BHO_G
  Top 0.406: R41.1 23.05,5.27 23.11,5.33 23.11,7.09
  Top 0.508: 23.11,7.09 Q4.1
BHS  (via drill 0.35)
  Top 0.406: v23.88,22.1 24.64,21.34 24.64,17.53 25.91,16.26 25.91,14.73 26.42,14.22 26.46,14.22 28.49,12.19 Q5.3
  Top 0.508: v35.81,26.42 35.81,29.21 | 35.81,29.21 U3.15 | C14.1 39.62,30.48 38.35,29.21 35.81,29.21
  Top 1.016: Q4.2 26.2,11.68 Q5.3
  Top 1.27: Q5.3 28.49,4.02 29.97,2.54 69.09,2.54 | X4.8 81.03,8.3 75.26,2.54 69.09,2.54 | C3.2 69.09,2.54
  Bottom 0.508: v23.88,22.1 24.89,23.11 24.89,24.64 26.67,26.42 v35.81,26.42
BLO  (via drill 0.35)
  Top 0.406: v30.73,28.19 32.26,28.19 32.51,27.94 32.51,15.49 34.04,13.97 34.04,10.67 35.37,9.33 R43.2
  Bottom 0.508: v30.73,28.19 30.73,30.73 U3.14
BLO_G
  Top 0.406: Q5.1 37.09,7.12 37.4,7.43 R43.1
BLS
  Top 0.508: R28.1 46.92,10.41 R27.2
  Top 1.016: R27.2 41.66,10.41 40.39,11.68 Q5.2
BTN_DOWN
  Top 0.254: R14.2 R11.1 34.8,89.66 U2.19 36.58,91.44 | 39.12,94.74 65.79,94.74 76.2,105.16 76.2,139.19 77.85,140.84 X2.3
  Top 0.305: 39.12,94.74 36.58,92.2 36.58,91.44
BTN_STOP
  Top 0.254: X2.5 77.72,127.38 77.72,104.65 U2.30 R10.1 R15.2
BTN_UP
  Top 0.254: R13.2 R12.1 U2.27 56.13,91.19 56.9,91.95 64.01,91.95 76.96,104.9 76.96,136.4 78.99,138.43 81.79,138.43 83.57,140.21 83.57,148.46 X2.1
DHT22_DATA  (via drill 0.35)
  Top 0.305: U1.DATA 9.14,73.66 18.1,82.62 R3.1 26.99,82.62 v29.97,85.6 | v45.97,96.01 36.32,96.01 32,91.69 v32,87.63
  Bottom 0.305: U2.23 v45.97,96.01 | v32,87.63 v29.97,85.6
GND  (via drill 0.35)
  Top 0.203: U9.3 v33.27,68.07
  Top 0.305: C26.1 37.75,72.37 v36.32,72.37 | R39.2 v27.69,74.42 | R34.1 v38.1,64.26
  Top 0.406: U5.2 63.49,76.71 | TP8.TP v26.67,53.85
  Top 0.508: C27.2 25.01,27.29 25.15,27.43 26.07,27.43 C17.2 | R24.1 23.94,39.18
  Top 0.635: C21.1 R32.1 v19.3,120.65 | C21.1 C20.2 v19.3,127.51 | U4.3 56.64,133.1 D1.A | R19.1 v32.51,80.52 | C11.1 v50.04,72.9 50.1,72.83 R31.1 | C6.1 v23.37,117.09 | R15.1 v66.29,83.57 | R13.1 v53.59,83.57 | v12.7,117.6 12.7,118.92 Q6.K 12.69,120.38 v12.7,120.4 | R29.1 v14.22,112.52 | C21.1 v19.3,124.71 | R14.1 v37.34,83.57 | R8.1 44.45,84.9 | 44.45,84.9 R6.1 | 44.45,84.9 v44.45,83.57 | U7.P$3 12.66,65.41 C12.2 | C13.2 12.75,65.42 C12.2 | C12.2 v12.7,66.55 | R23.1 v6.35,54.61 | C7.2 v55.37,72.9 | C8.2 v57.4,72.9 | C10.2 v59.44,73.66 | C9.2 v59.44,71.63 | v63.63,76.62 63.58,76.62 63.49,76.71 | v49.28,138.18 49.39,138.06 C4.2 49.39,135.75 v49.28,135.64 | D1.A 56.64,132.56 v56.64,131.57 | D1.A 57.66,132.62 v57.66,131.57 | D1.A 57.91,133.1 58.17,132.84 v58.93,132.84 | R30.1 v69.6,119.38 | T3.C v52.32,59.94 | T1.2 57.32,61.55 v57.4,61.47 | Q1.2 69.31,53.59 v68.07,53.59 | Q1.2 v69.34,52.08 v69.34,52.07 | Q1.2 70.59,53.62 v70.61,53.59 | Q1.2 v69.34,55.12 | C22.2 26.76,58.76 26.44,58.44 IC2.3 27.62,57.59 v27.94,57.91 | C23.1 33.44,54.27 33.78,54.61 33.76,54.63 IC1.3 32.58,55.69 v32.51,55.63 | 23.94,39.18 U3.6 | v27.43,27.43 26.25,27.43 C17.2 | R26.1 45.47,20.06 46.06,19.47 C18.2 | C19.2 44.54,16.34 44.2,16.01 R27.1 | 56.39,144.53 57.66,145.8 | 21.11,134.33 D4.A | TP5.TP v41.91,56.13
  Top 0.813: v62.74,131.83 62.74,133.81 | 62.74,133.81 R33.1 | v61.21,133.6 61.42,133.81 62.74,133.81
  Top 1.016: v21.84,138.94 20.32,138.94 | v21.84,137.41 21.84,137.45 19.85,139.45 19.85,141.26 v20.57,141.99 | v21.84,140.46 20.32,138.94 | 20.32,138.94 19.85,138.94 L2.4 19.81,139.03 19.81,141.22 v19.05,141.99
  Top 1.27: R16.1 v63.75,142.49 | 21.11,134.33 19.78,135.66 L2.4
  Bottom 0.635: v49.28,138.18 50.55,136.91 v49.28,135.64 | v69.6,116.33 v69.6,119.38
  Bottom 0.813: v62.74,131.83 62.74,132.59 61.72,133.6 v61.21,133.6 60.45,132.84 v58.93,132.84
  Bottom 1.27: C2.NEG 46.08,136.91 50.55,136.91 52.07,136.91 57.4,131.57 | 57.4,131.57 v56.64,131.57 53.85,128.78 28.7,128.78 v28.45,128.52 | v61.72,117.35 61.72,127.25 57.4,131.57
  other vias: 50.29,147.57 50.29,146.05 50.29,149.1 50.29,144.53 62.99,144.27 62.99,145.8 62.99,147.32 62.99,148.84 41.4,18.03 42.42,18.03 43.43,18.03 44.45,18.03
  pour Bottom: 0.76,0.51 0.76,155.19 29.97,155.19 29.97,118.36 73.41,118.36 73.41,155.19 85.85,155.19 85.85,0.51
  pour Bottom: 52.58,130.56 59.44,154.94 59.44,130.56
  pour Bottom: 52.58,142.75 40.64,142.75 40.64,154.94 71.12,154.94 71.12,140.97 52.58,140.97
  pour Top (no thermals): 40.89,15.24 40.89,20.83 44.96,20.83 44.96,15.24
  pour Top (no thermals): 49.53,149.61 63.5,149.61 63.5,143.76 49.53,143.76
HIP4082_BOOTA
  Top 0.635: D3.C 14.34,36.12 C15.1 14.34,31.63 14.73,31.24 U3.9
HIP4082_BOOTB
  Top 0.635: D2.C 37.91,41.72 36.32,40.13 U3.1 36.32,36.07 38.72,33.67 C14.2
HIP4082_DLY
  Top 0.635: R24.2 25.84,39.18 U3.5
LED_3V3_ADC
  Top 0.635: R31.2 52,73.81 LED3.C
LED_5V
  Top 0.635: LED2.C 69.5,123.22 R30.2
LED_12V
  Top 0.635: R29.2 17.46,113.98 17.56,114.08 LED1.C
LIGHT_GATE_PRERES
  Top 0.635: T3.E 50.38,63.84 49.53,62.99 49.53,58.17 50.46,57.23 50.7,57.23 | R1.1 50.7,57.23 | 50.7,57.23 T2.2
LIGHT_OUT
  Top 2.54: Q1.3 67.78,60.2 72.39,60.2 74.93,57.66 74.93,43.43 78.06,40.3 X4.2
LIGHT_PWM  (via drill 0.35)
  Top 0.508: R17.1 v52.32,78.23
  Top 0.635: v53.85,70.61 53.85,69.09 53.15,68.39 R5.1
  Bottom 0.508: v52.32,78.23 53.85,78.23
  Bottom 0.635: U2.26 53.59,86.11 55.12,84.58 55.12,82.3 53.85,81.03 53.85,78.23 v53.85,70.61
LIGHT_PWM_BASE
  Top 0.305: TP10.TP 56.77,66.42
  Top 0.635: R5.2 56.39,66.8 56.77,66.42 57.32,65.87 T1.1
LIGHT_PWM_EMITTER
  Top 0.635: T1.3 59.52,59.71 58.67,58.86 R4.1 58.99,58.86 59.62,58.23 R2.1
LIGHT_PWM_TOTEM
  Top 0.635: T2.1 54.27,57.23 54.36,57.15 54.86,57.66 | 54.86,57.66 55.25,58.04 55.25,62.87 54.27,63.84 T3.B | R4.2 55.56,56.96 54.86,57.66
LIGHT_SENSOR  (via drill 0.35)
  Top 0.254: 24.38,73.41 24.38,68.58 v26.92,66.04 | v31.5,65.53 32.26,65.53 32.77,66.04 40.13,66.04 40.47,66.38 U9.6
  Top 0.305: TP4.TP 17.78,66.8
  Top 0.406: R23.2 11.18,54.61 16.76,60.2 16.76,65.79 17.78,66.8 24.38,73.41 24.38,76.2 U6.9 | U2.1 63.75,114.55 62.74,115.57 32.77,115.57 32,114.81 32,98.04 v28.19,94.23
  Top 0.508: U8.2 9.79,56.02 9.59,55.81 R23.2
  Bottom 0.254: v26.92,66.04 30.99,66.04 v31.5,65.53
  Bottom 0.406: v28.19,94.23 26.67,92.71 26.67,81.53 25.65,80.52 U6.9
LIGHT_SENSOR_VDD
  Top 0.508: 11.68,61.21 10.16,59.69 R22.2
  Top 0.635: C13.1 12.75,63.62 | 12.75,63.62 C12.1 | U7.P$2 11.56,64.13 12.08,63.62 12.75,63.62 | 12.75,63.62 12.75,62.28 11.68,61.21
LIGHT_VGATE
  Top 0.305: TP9.TP 62.48,51.31
  Top 0.635: R1.2 50.8,53.15 52.64,51.31 62.48,51.31 64.01,51.31 64.78,52.08 Q1.1
MAIN_DOOR  (via drill 0.35)
  Top 0.254: R7.1 R6.2 45.72,88.14 43.43,90.42 U2.22
  Top 0.305: v40.64,82.04 41.91,80.77 75.95,80.77 77.47,82.3 77.47,86.61 78.89,88.03 X3.3
  Bottom 0.305: U2.22 43.43,89.66 39.88,86.11 39.88,82.8 v40.64,82.04
MOTOR_EN  (via drill 0.35)
  Top 0.305: v29.46,73.15 29.46,57.4 28.7,56.64 IC2.2
  Bottom 0.305: U2.18 33.27,87.38 29.46,83.57 v29.46,73.15
MOTOR_PWM  (via drill 0.35)
  Top 0.254: R34.2 30.48,64.26
  Top 0.305: v34.54,73.15 32.51,73.15 30.48,71.12 30.48,64.26 30.48,57.66 31.5,56.64 | IC1.2 31.5,56.64 | 31.5,56.64 30.48,55.63 v30.48,50.8 | v30.48,42.93 30.48,41.4 28.7,39.62 U3.4
  Top 0.406: v30.48,50.8 27.43,50.8 TP6.TP
  Bottom 0.305: U2.20 38.35,89.15 37.34,88.14 37.34,84.93 34.54,82.14 v34.54,73.15 | v30.48,50.8 v30.48,42.93
MOTOR_SNUB_RC
  Top 1.27: C3.1 70.55,6.79 70.86,7.11 R35.2
N$1
  Top 0.635: U6.10 23.11,76.96 22.35,76.2 TP2.TP
N$2
  Top 0.203: U9.2 36.58,68.58 36.58,69.85 35.81,70.61 TP12.TP
N$3  (via drill 0.35)
  Top 0.203: U9.1 32.02,69.07 v32,69.09 | v27.69,69.09 R39.1
  Bottom 0.203: v32,69.09 v27.69,69.09
N$4
  Top 0.203: U9.7 41.9,67.57 42.16,67.31 TP13.TP
NESTING_BOX
  Top 0.254: R8.2 R9.1 40.64,88.65 40.89,88.9 U2.21
  Top 0.305: R9.1 39.3,86.8 39.12,86.61 39.12,82.04 41.4,79.76 79.14,79.76 X3.5
SCL  (via drill 0.35)
  Top 0.203: U9.10 40.47,69.93 40.64,70.1 40.64,71.37 v40.51,71.5
  Top 0.254: U2.29 R20.1 | v61.21,92.71 61.16,92.66 56.2,92.66 56,92.46 v42.16,92.46 | U7.P$1 7.75,62.87 7.37,63.25 7.37,67.82 8.38,68.83 16.51,68.83 18.54,70.87 18.54,77.98 22.35,81.79 30.34,81.79 31.31,82.75 37.53,82.75 38.3,81.98 38.3,80.06 U6.3
  Bottom 0.254: v42.16,92.46 42.16,89.66 41.4,88.9 40.64,88.9 39.12,87.38 39.12,79.25 U6.3 40.89,71.63 40.64,71.37 v40.51,71.5 | v61.21,92.71 U2.29
SDA  (via drill 0.35)
  Top 0.203: 39.37,69.85 39.12,69.6 39.12,68.83 39.38,68.57 U9.9
  Top 0.254: U2.28 R21.1 | U7.P$4 9.4,66.67 10.79,68.07 17.02,68.07 19.3,70.36 19.3,77.72 22.61,81.03 30.73,81.03 32,82.3 36.83,82.3 37.34,81.79 37.34,78.49 U6.4 | v58.67,93.47 v39.62,93.47 | v39.37,72.64 39.37,69.85
  Bottom 0.254: U6.4 38.35,87.63 39.62,88.9 v39.62,93.47 | v58.67,93.47 U2.28
  Bottom 0.305: U6.4 39.37,76.45 v39.37,72.64
VADC_EN
  Top 0.305: U5.3 63.82,77.66 64.07,77.4 R18.2
VIN+
  Top 1.27: X1.1 10.28,151 12.19,152.91 17.78,152.91 19.78,150.9 L2.1
VIN-
  Top 0.635: 16.26,147.53 L2.2
  Top 1.27: X1.2 8,145.92 12.93,150.86 15.77,150.86 16.26,150.37 16.26,147.53
VIN_CROWBAR_GATE
  Top 0.635: D5.1 24.37,124.71 C21.2 R32.2 22.54,119.31 22.1,118.87 18.03,118.87 17.97,118.93 Q6.G

### Text on the board
Reference: BTN / UP | - 12VDC + | BTN / DOWN | 3A | BTN / STOP | 0.4A | 5VOUT / - + | MAIN / DOOR | NEST / BOX | LIGHT / - + | MTRB / - + | MTRA / - + | COOP ASSISTANT / 1/8/22 - REV A